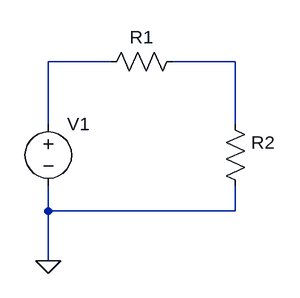
[diagram p0: schematic simple_R_series.asc]
simple_R_series.asc, the LTspice schematic file:
Version 4
SHEET 1 880 680
WIRE 192 -16 112 -16
WIRE 352 -16 272 -16
WIRE 112 64 112 -16
WIRE 352 64 352 -16
WIRE 112 176 112 144
WIRE 352 176 352 144
WIRE 352 176 112 176
WIRE 112 240 112 176
FLAG 112 240 0
SYMBOL voltage 112 48 R0
WINDOW 123 0 0 Left 0
WINDOW 39 0 0 Left 0
SYMATTR InstName V1
SYMATTR Value ""
SYMBOL res 336 48 R0
SYMATTR InstName R2
SYMATTR Value ""
SYMBOL res 288 -32 R90
WINDOW 0 0 56 VBottom 2
WINDOW 3 32 56 VTop 2
SYMATTR InstName R1
SYMATTR Value ""

The netlist it stands for:
* simple_R_series.asc
V1 N001 0
R2 N002 0
R1 N002 N001
.backanno
.end